# Altium project H4_6-port_EtherCAT_Junction_Module.PrjPcb (part 1 of 7)
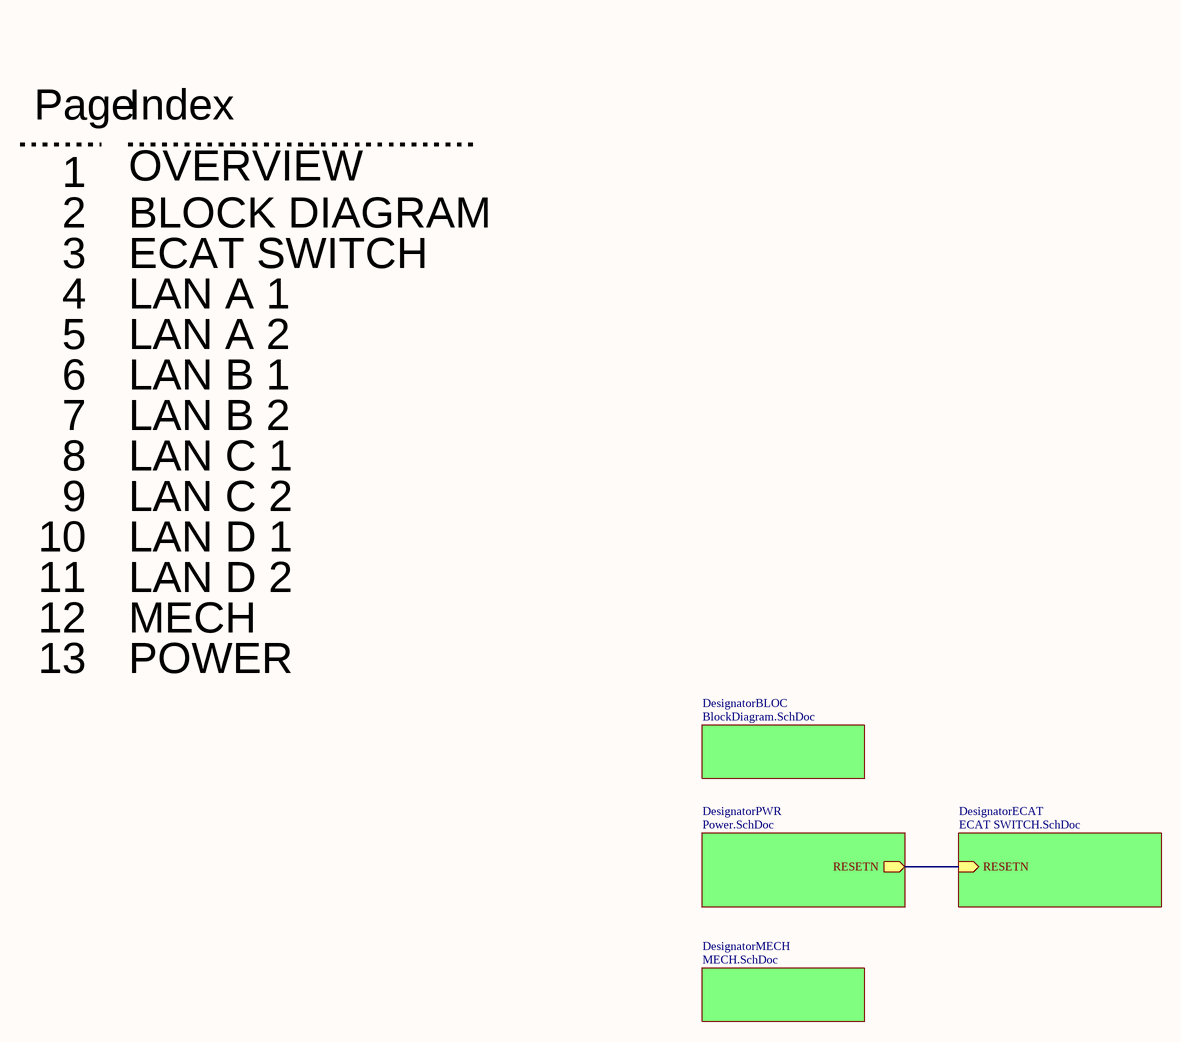
[diagram p0: Overview.SchDoc]
Cur_Revision: 1.2; Project_Title: H4 6-port EthercAT Junction Module; Project_Rev_Date_3: 2023-03-06; Project_Rev_Date_2: 2023-09-15; Project_Rev_Date: 2023-07-01; Project_Revision_Description_3: Power vias under U1 and Silkscreen update; Project_Revision_Description_2: Ethernet ESD Protections added; Project_Revision_Description: Initial release; Project_Revision_3: 1.2; Project_Revision_2: 1.1; Project_Revision: 1.0; Project_Date: 04/07/2023; Project_Author_Checked: Alexis M.; Project_Author: Chandra U.; PCB_Name: H4_6port_Junction_Module
13 sheets, 564 parts. Net scope: hierarchical (ports join the sheet entries above them; power ports are global).
Board file: H4_6-port_EtherCAT_Junction_Module.PcbDoc
Sheets:
  Overview.SchDoc
    DesignatorECAT = ECAT SWITCH.SchDoc
      LAN A - DOWNSTREAM = LAN9254_A_P2.SchDoc
      LAN B - UPSTREAM = LAN9254_B_P2.SchDoc
      LAN C - DOWNSTREAM = LAN9254_C_P2.SchDoc
      LAN D - UPSTREAM = LAN9254_D_P2.SchDoc
      LAN B = LAN9254_B_P1.SchDoc
      LAN C = LAN9254_C_P1.SchDoc
      LAN D = LAN9254_D_P1.SchDoc
      LAN A = LAN9254_A_P1.SchDoc
    DesignatorPWR = POWER.SchDoc
    DesignatorMECH = MECH.SchDoc
    DesignatorBLOC = BlockDiagram.SchDoc

## Sheet Overview.SchDoc
size 431 x 279 mm; SheetNumber: 1; SheetTotal: 13

### Sub-sheets
DesignatorBLOC = BlockDiagram.SchDoc: no entries
DesignatorECAT = ECAT SWITCH.SchDoc: RESETN (in)
DesignatorMECH = MECH.SchDoc: no entries
DesignatorPWR = Power.SchDoc: RESETN (out)

### Nets
RESETN: sheet DesignatorECAT/RESETN, sheet DesignatorPWR/RESETN

### Notes on the sheet
- Page
- Index
- 1
- OVERVIEW
- 2
- 3
- BLOCK DIAGRAM
- ECAT SWITCH
- 4
- 5
- LAN A 1
- LAN A 2
- 6
- LAN B 1
- 7
- 8
- LAN B 2
- LAN C 1
- 9
- 10
- LAN C 2
- LAN D 1
- 11
- LAN D 2
- 12
- 13
- POWER
- MECH
- REVISION
- DESCRIPTION
- DATE
- DESIGNED:
- CHECKED:
- TITLE:
- FILE NAME:
- CUR REV:
- PCB:
- SHEET:
- DATE:
- OF

## Sheet ECAT SWITCH.SchDoc
size 431 x 279 mm; DocumentNumber: 6; SheetNumber: 3; SheetTotal: 13
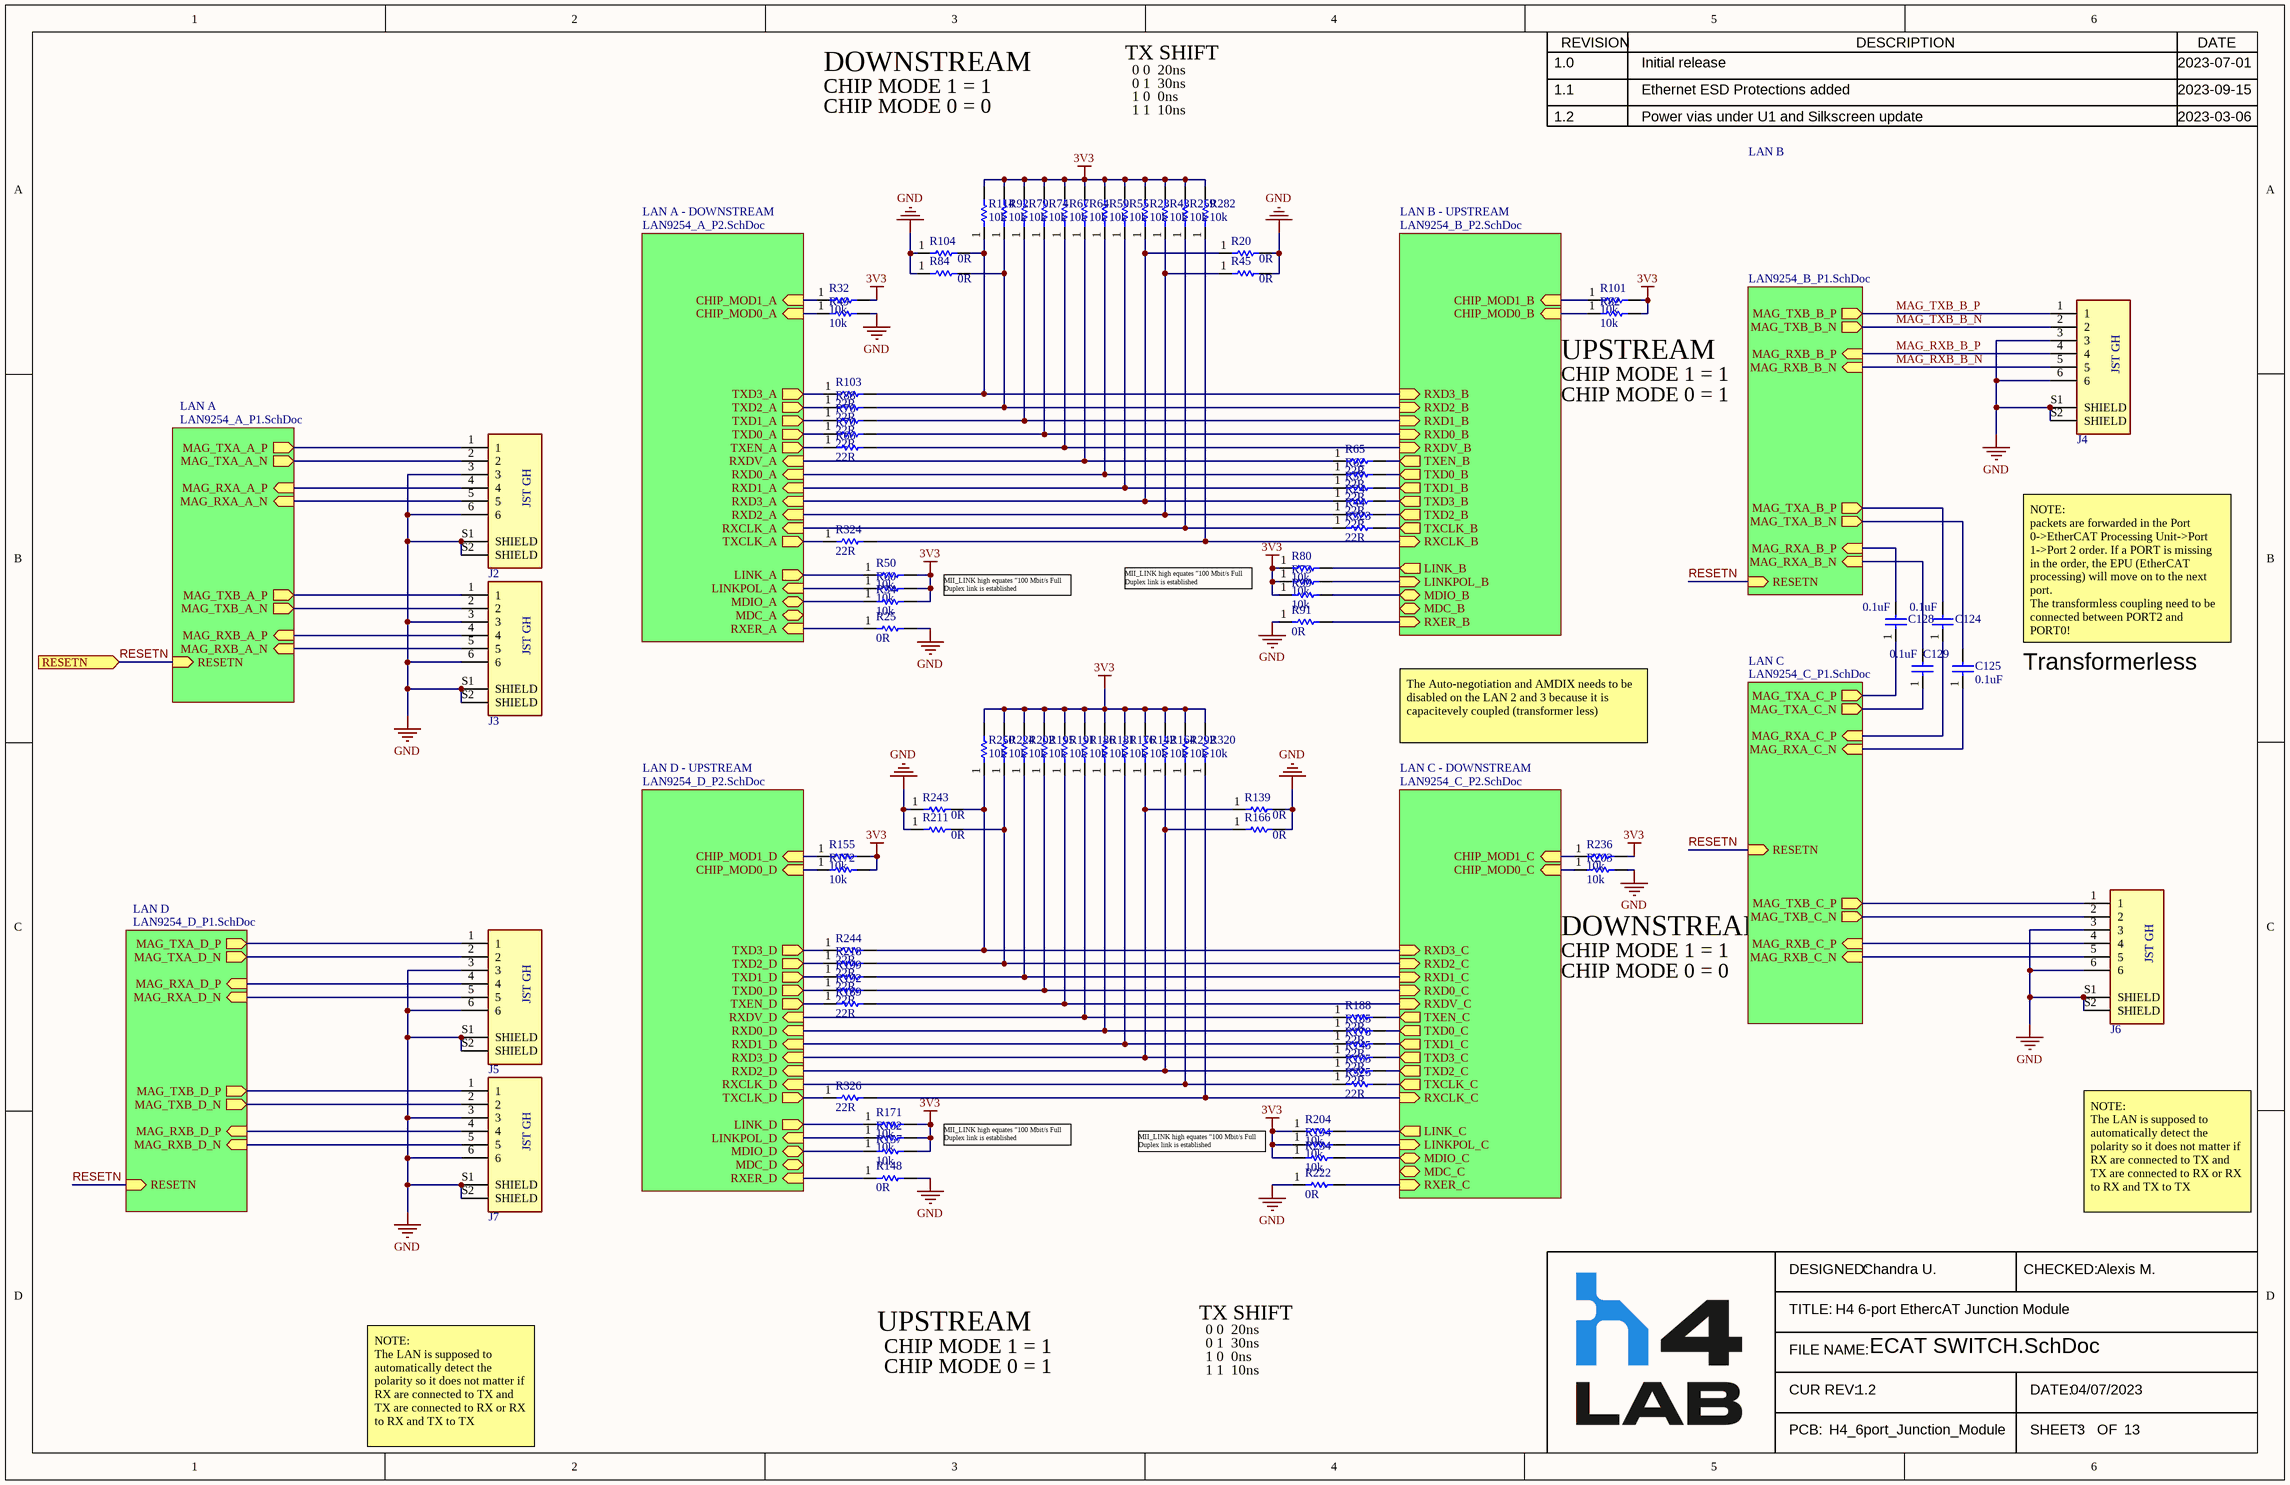
[diagram p1: ECAT SWITCH.SchDoc]

### Parts
C124  value 0.1uF  [CAPC1608X09N(0603)]  (hidden comment: CL10B104KC8NNNC)
C125  value 0.1uF  [CAPC1608X09N(0603)]  (hidden comment: CL10B104KC8NNNC)
C128  value 0.1uF  [CAPC1608X09N(0603)]  (hidden comment: CL10B104KC8NNNC)
C129  value 0.1uF  [CAPC1608X09N(0603)]  (hidden comment: CL10B104KC8NNNC)
J2  BM06B-GHS-TBT  [JST_GH_6POS_STRAI]  (value not drawn)
J3  BM06B-GHS-TBT  [JST_GH_6POS_STRAI]  (value not drawn)
J4  BM06B-GHS-TBT  [JST_GH_6POS_STRAI]  (value not drawn)
J5  BM06B-GHS-TBT  [JST_GH_6POS_STRAI]  (value not drawn)
J6  BM06B-GHS-TBT  [JST_GH_6POS_STRAI]  (value not drawn)
J7  BM06B-GHS-TBT  [JST_GH_6POS_STRAI]  (value not drawn)
R20  value 0R  [RESC1608X09N(0603)]  (hidden comment: RC0603JR-070RL)
R23  value 10k  [RESC1005X06N(0402)]  (hidden comment: RC0402FR-0710KL)
R24  value 22R  [0402]  (hidden comment: CRGP0402F22R)
R25  value 0R  [0402]  (hidden comment: RCS04020000Z0ED)
R32  value 10k  [RESC1005X06N(0402)]  (hidden comment: RC0402FR-0710KL)
R34  value 10k  [RESC1005X06N(0402)]  (hidden comment: RC0402FR-0710KL)
R43  value 10k  [RESC1005X06N(0402)]  (hidden comment: RC0402FR-0710KL)
R44  value 22R  [0402]  (hidden comment: CRGP0402F22R)
R45  value 0R  [RESC1608X09N(0603)]  (hidden comment: RC0603JR-070RL)
R49  value 10k  [RESC1005X06N(0402)]  (hidden comment: RC0402FR-0710KL)
R50  value 10k  [RESC1005X06N(0402)]  (hidden comment: RC0402FR-0710KL)
R55  value 10k  [RESC1005X06N(0402)]  (hidden comment: RC0402FR-0710KL)
R57  value 22R  [0402]  (hidden comment: CRGP0402F22R)
R59  value 10k  [RESC1005X06N(0402)]  (hidden comment: RC0402FR-0710KL)
R60  value 10k  [RESC1005X06N(0402)]  (hidden comment: RC0402FR-0710KL)
R62  value 22R  [0402]  (hidden comment: CRGP0402F22R)
R64  value 10k  [RESC1005X06N(0402)]  (hidden comment: RC0402FR-0710KL)
R65  value 22R  [0402]  (hidden comment: CRGP0402F22R)
R66  value 22R  [0402]  (hidden comment: CRGP0402F22R)
R67  value 10k  [RESC1005X06N(0402)]  (hidden comment: RC0402FR-0710KL)
R70  value 22R  [0402]  (hidden comment: CRGP0402F22R)
R73  value 10k  [RESC1005X06N(0402)]  (hidden comment: RC0402FR-0710KL)
R74  value 10k  [RESC1005X06N(0402)]  (hidden comment: RC0402FR-0710KL)
R76  value 22R  [0402]  (hidden comment: CRGP0402F22R)
R79  value 10k  [RESC1005X06N(0402)]  (hidden comment: RC0402FR-0710KL)
R80  value 10k  [RESC1005X06N(0402)]  (hidden comment: RC0402FR-0710KL)
R82  value 10k  [RESC1005X06N(0402)]  (hidden comment: RC0402FR-0710KL)
R84  value 0R  [RESC1608X09N(0603)]  (hidden comment: RC0603JR-070RL)
R88  value 22R  [0402]  (hidden comment: CRGP0402F22R)
R91  value 0R  [0402]  (hidden comment: RCS04020000Z0ED)
R92  value 10k  [RESC1005X06N(0402)]  (hidden comment: RC0402FR-0710KL)
R99  value 10k  [RESC1005X06N(0402)]  (hidden comment: RC0402FR-0710KL)
R101  value 10k  [RESC1005X06N(0402)]  (hidden comment: RC0402FR-0710KL)
R103  value 22R  [0402]  (hidden comment: CRGP0402F22R)
R104  value 0R  [RESC1608X09N(0603)]  (hidden comment: RC0603JR-070RL)
R114  value 10k  [RESC1005X06N(0402)]  (hidden comment: RC0402FR-0710KL)
R139  value 0R  [RESC1608X09N(0603)]  (hidden comment: RC0603JR-070RL)
R142  value 10k  [RESC1005X06N(0402)]  (hidden comment: RC0402FR-0710KL)
R145  value 22R  [0402]  (hidden comment: CRGP0402F22R)
R148  value 0R  [0402]  (hidden comment: RCS04020000Z0ED)
R155  value 10k  [RESC1005X06N(0402)]  (hidden comment: RC0402FR-0710KL)
R157  value 10k  [RESC1005X06N(0402)]  (hidden comment: RC0402FR-0710KL)
R164  value 10k  [RESC1005X06N(0402)]  (hidden comment: RC0402FR-0710KL)
R165  value 22R  [0402]  (hidden comment: CRGP0402F22R)
R166  value 0R  [RESC1608X09N(0603)]  (hidden comment: RC0603JR-070RL)
R171  value 10k  [RESC1005X06N(0402)]  (hidden comment: RC0402FR-0710KL)
R172  value 10k  [RESC1005X06N(0402)]  (hidden comment: RC0402FR-0710KL)
R176  value 10k  [RESC1005X06N(0402)]  (hidden comment: RC0402FR-0710KL)
R178  value 22R  [0402]  (hidden comment: CRGP0402F22R)
R181  value 10k  [RESC1005X06N(0402)]  (hidden comment: RC0402FR-0710KL)
R182  value 10k  [RESC1005X06N(0402)]  (hidden comment: RC0402FR-0710KL)
R185  value 22R  [0402]  (hidden comment: CRGP0402F22R)
R186  value 10k  [RESC1005X06N(0402)]  (hidden comment: RC0402FR-0710KL)
R188  value 22R  [0402]  (hidden comment: CRGP0402F22R)
R189  value 22R  [0402]  (hidden comment: CRGP0402F22R)
R191  value 10k  [RESC1005X06N(0402)]  (hidden comment: RC0402FR-0710KL)
R192  value 22R  [0402]  (hidden comment: CRGP0402F22R)
R194  value 10k  [RESC1005X06N(0402)]  (hidden comment: RC0402FR-0710KL)
R195  value 10k  [RESC1005X06N(0402)]  (hidden comment: RC0402FR-0710KL)
R199  value 22R  [0402]  (hidden comment: CRGP0402F22R)
R202  value 10k  [RESC1005X06N(0402)]  (hidden comment: RC0402FR-0710KL)
R203  value 10k  [RESC1005X06N(0402)]  (hidden comment: RC0402FR-0710KL)
R204  value 10k  [RESC1005X06N(0402)]  (hidden comment: RC0402FR-0710KL)
R211  value 0R  [RESC1608X09N(0603)]  (hidden comment: RC0603JR-070RL)
R218  value 22R  [0402]  (hidden comment: CRGP0402F22R)
R222  value 0R  [0402]  (hidden comment: RCS04020000Z0ED)
R224  value 10k  [RESC1005X06N(0402)]  (hidden comment: RC0402FR-0710KL)
R234  value 10k  [RESC1005X06N(0402)]  (hidden comment: RC0402FR-0710KL)
R236  value 10k  [RESC1005X06N(0402)]  (hidden comment: RC0402FR-0710KL)
R243  value 0R  [RESC1608X09N(0603)]  (hidden comment: RC0603JR-070RL)
R244  value 22R  [0402]  (hidden comment: CRGP0402F22R)
R250  value 10k  [RESC1005X06N(0402)]  (hidden comment: RC0402FR-0710KL)
R259  value 10k  [RESC1005X06N(0402)]  (hidden comment: RC0402FR-0710KL)
R282  value 10k  [RESC1005X06N(0402)]  (hidden comment: RC0402FR-0710KL)
R292  value 10k  [RESC1005X06N(0402)]  (hidden comment: RC0402FR-0710KL)
R320  value 10k  [RESC1005X06N(0402)]  (hidden comment: RC0402FR-0710KL)
R323  value 22R  [0402]  (hidden comment: CRGP0402F22R)
R324  value 22R  [0402]  (hidden comment: CRGP0402F22R)
R325  value 22R  [0402]  (hidden comment: CRGP0402F22R)
R326  value 22R  [0402]  (hidden comment: CRGP0402F22R)

### Sub-sheets
LAN A = LAN9254_A_P1.SchDoc: MAG_TXA_A_P (out), MAG_TXA_A_N (out), MAG_RXA_A_P (in), MAG_RXA_A_N (in), MAG_TXB_A_P (out), MAG_TXB_A_N (out), MAG_RXB_A_P (in), MAG_RXB_A_N (in), RESETN (in)
LAN A - DOWNSTREAM = LAN9254_A_P2.SchDoc: CHIP_MOD0_A (in), CHIP_MOD1_A (in), TXD3_A (out), TXD2_A (out), TXD1_A (out), TXD0_A (out), TXEN_A (out), RXD0_A (in), RXD1_A (in), LINKPOL_A (in), RXD3_A (in), RXD2_A (in), RXER_A (in), RXCLK_A (in), MDIO_A (bidir), MDC_A (bidir), LINK_A (out), RXDV_A (in), TXCLK_A (out)
LAN B = LAN9254_B_P1.SchDoc: MAG_TXA_B_P (out), MAG_TXA_B_N (out), MAG_RXA_B_P (in), MAG_RXA_B_N (in), MAG_TXB_B_P (out), MAG_TXB_B_N (out), MAG_RXB_B_P (in), MAG_RXB_B_N (in), RESETN (in)
LAN B - UPSTREAM = LAN9254_B_P2.SchDoc: CHIP_MOD0_B (in), CHIP_MOD1_B (in), TXD3_B (out), TXD2_B (out), TXD1_B (out), TXD0_B (out), TXEN_B (out), RXD0_B (in), RXD1_B (in), LINKPOL_B (in), RXD3_B (in), RXD2_B (in), RXER_B (in), RXCLK_B (in), MDIO_B (bidir), MDC_B (bidir), LINK_B (out), RXDV_B (in), TXCLK_B (out)
LAN C = LAN9254_C_P1.SchDoc: MAG_TXA_C_P (out), MAG_TXA_C_N (out), MAG_RXA_C_P (in), MAG_RXA_C_N (in), MAG_TXB_C_P (out), MAG_TXB_C_N (out), MAG_RXB_C_P (in), MAG_RXB_C_N (in), RESETN (in)
LAN C - DOWNSTREAM = LAN9254_C_P2.SchDoc: CHIP_MOD0_C (in), CHIP_MOD1_C (in), TXD3_C (out), TXD2_C (out), TXD1_C (out), TXD0_C (out), TXEN_C (out), RXD0_C (in), RXD1_C (in), LINKPOL_C (in), RXD3_C (in), RXD2_C (in), RXER_C (in), RXCLK_C (in), MDIO_C (bidir), MDC_C (bidir), LINK_C (out), RXDV_C (in), TXCLK_C (out)
LAN D = LAN9254_D_P1.SchDoc: MAG_TXA_D_P (out), MAG_TXA_D_N (out), MAG_RXA_D_P (in), MAG_RXA_D_N (in), MAG_TXB_D_P (out), MAG_TXB_D_N (out), MAG_RXB_D_P (in), MAG_RXB_D_N (in), RESETN (in)
LAN D - UPSTREAM = LAN9254_D_P2.SchDoc: CHIP_MOD0_D (in), CHIP_MOD1_D (in), TXD3_D (out), TXD2_D (out), TXD1_D (out), TXD0_D (out), TXEN_D (out), RXD0_D (in), RXD1_D (in), LINKPOL_D (in), RXD3_D (in), RXD2_D (in), RXER_D (in), RXCLK_D (in), MDIO_D (bidir), MDC_D (bidir), LINK_D (out), RXDV_D (in), TXCLK_D (out)

### Ports
RESETN (in, see Overview[4D], LAN9254_A_P1[2B], LAN9254_B_P1[2B], LAN9254_C_P1[2B], LAN9254_D_P1[2B], POWER[2D])

### Nets
3V3: R23.2 R32.2 R34.2 R43.2 R50.2 R55.2 R59.2 R60.2 R64.2 R67.2 R73.1 R74.2 R79.2 R80.1 R82.2 R92.2 R99.1 R101.2 R114.2 R142.2 R155.2 R157.2 R164.2 R171.2 R172.2 R176.2 R181.2 R182.2 R186.2 R191.2 R194.1 R195.2 R202.2 R204.1 R224.2 R234.1 R236.2 R250.2 R259.2 R282.2 R292.2 R320.2
GND: J2.3 J2.6 J2.S1(SHIELD) J2.S2(SHIELD) J3.3 J3.6 J3.S1(SHIELD) J3.S2(SHIELD) J4.3 J4.6 J4.S1(SHIELD) J4.S2(SHIELD) J5.3 J5.6 J5.S1(SHIELD) J5.S2(SHIELD) J6.3 J6.6 J6.S1(SHIELD) J6.S2(SHIELD) J7.3 J7.6 J7.S1(SHIELD) J7.S2(SHIELD) R20.2 R25.2 R45.2 R49.2 R84.1 R91.1 R104.1 R139.2 R148.2 R166.2 R203.2 R211.1 R222.1 R243.1
CHIP_MOD0_A: R49.1 ; sheet LAN A - DOWNSTREAM/CHIP_MOD0_A
CHIP_MOD0_B: R82.1 ; sheet LAN B - UPSTREAM/CHIP_MOD0_B
CHIP_MOD0_C: R203.1 ; sheet LAN C - DOWNSTREAM/CHIP_MOD0_C
CHIP_MOD0_D: R172.1 ; sheet LAN D - UPSTREAM/CHIP_MOD0_D
CHIP_MOD1_A: R32.1 ; sheet LAN A - DOWNSTREAM/CHIP_MOD1_A
CHIP_MOD1_B: R101.1 ; sheet LAN B - UPSTREAM/CHIP_MOD1_B
CHIP_MOD1_C: R236.1 ; sheet LAN C - DOWNSTREAM/CHIP_MOD1_C
CHIP_MOD1_D: R155.1 ; sheet LAN D - UPSTREAM/CHIP_MOD1_D
DIGIO3_A: R50.1 ; sheet LAN A - DOWNSTREAM/LINK_A
DIGIO3_B: R80.2 ; sheet LAN B - UPSTREAM/LINK_B
DIGIO3_C: R204.2 ; sheet LAN C - DOWNSTREAM/LINK_C
DIGIO3_D: R171.1 ; sheet LAN D - UPSTREAM/LINK_D
DIGIO10_A: R60.1 ; sheet LAN A - DOWNSTREAM/LINKPOL_A
DIGIO10_B: R73.2 ; sheet LAN B - UPSTREAM/LINKPOL_B
DIGIO10_C: R194.2 ; sheet LAN C - DOWNSTREAM/LINKPOL_C
DIGIO10_D: R182.1 ; sheet LAN D - UPSTREAM/LINKPOL_D
MAG_RXA_A_N: J2.5 ; sheet LAN A/MAG_RXA_A_N
MAG_RXA_A_P: J2.4 ; sheet LAN A/MAG_RXA_A_P
MAG_RXA_D_N: J5.5 ; sheet LAN D/MAG_RXA_D_N
MAG_RXA_D_P: J5.4 ; sheet LAN D/MAG_RXA_D_P
MAG_RXB_A_N: J3.5 ; sheet LAN A/MAG_RXB_A_N
MAG_RXB_A_P: J3.4 ; sheet LAN A/MAG_RXB_A_P
MAG_RXB_B_N: J4.5 ; sheet LAN B/MAG_RXB_B_N
MAG_RXB_B_P: J4.4 ; sheet LAN B/MAG_RXB_B_P
MAG_RXB_C_N: J6.5 ; sheet LAN C/MAG_RXB_C_N
MAG_RXB_C_P: J6.4 ; sheet LAN C/MAG_RXB_C_P
MAG_RXB_D_N: J7.5 ; sheet LAN D/MAG_RXB_D_N
MAG_RXB_D_P: J7.4 ; sheet LAN D/MAG_RXB_D_P
MAG_TXA_A_N: J2.2 ; sheet LAN A/MAG_TXA_A_N
MAG_TXA_A_P: J2.1 ; sheet LAN A/MAG_TXA_A_P
MAG_TXA_D_N: J5.2 ; sheet LAN D/MAG_TXA_D_N
MAG_TXA_D_P: J5.1 ; sheet LAN D/MAG_TXA_D_P
MAG_TXB_A_N: J3.2 ; sheet LAN A/MAG_TXB_A_N
MAG_TXB_A_P: J3.1 ; sheet LAN A/MAG_TXB_A_P
MAG_TXB_B_N: J4.2 ; sheet LAN B/MAG_TXB_B_N
MAG_TXB_B_P: J4.1 ; sheet LAN B/MAG_TXB_B_P
MAG_TXB_C_N: J6.2 ; sheet LAN C/MAG_TXB_C_N
MAG_TXB_C_P: J6.1 ; sheet LAN C/MAG_TXB_C_P
MAG_TXB_D_N: J7.2 ; sheet LAN D/MAG_TXB_D_N
MAG_TXB_D_P: J7.1 ; sheet LAN D/MAG_TXB_D_P
MDIO_A: R34.1 ; sheet LAN A - DOWNSTREAM/MDIO_A
MDIO_B: R99.2 ; sheet LAN B - UPSTREAM/MDIO_B
MDIO_C: R234.2 ; sheet LAN C - DOWNSTREAM/MDIO_C
MDIO_D: R157.1 ; sheet LAN D - UPSTREAM/MDIO_D
P0_RD_B_N: C129.2 ; sheet LAN B/MAG_RXA_B_N
P0_RD_B_P: C128.2 ; sheet LAN B/MAG_RXA_B_P
P0_RD_C_N: C125.1 ; sheet LAN C/MAG_RXA_C_N
P0_RD_C_P: C124.1 ; sheet LAN C/MAG_RXA_C_P
P0_TD_B_N: C125.2 ; sheet LAN B/MAG_TXA_B_N
P0_TD_B_P: C124.2 ; sheet LAN B/MAG_TXA_B_P
P0_TD_C_N: C129.1 ; sheet LAN C/MAG_TXA_C_N
P0_TD_C_P: C128.1 ; sheet LAN C/MAG_TXA_C_P
RESETN: port RESETN, sheet LAN B/RESETN, sheet LAN C/RESETN, sheet LAN D/RESETN, sheet LAN A/RESETN
RXCLK_A: R259.1 R323.1 ; sheet LAN A - DOWNSTREAM/RXCLK_A
RXCLK_B: R282.1 R324.2 ; sheet LAN B - UPSTREAM/RXCLK_B
RXCLK_C: R320.1 R326.2 ; sheet LAN C - DOWNSTREAM/RXCLK_C
RXCLK_D: R292.1 R325.1 ; sheet LAN D - UPSTREAM/RXCLK_D
RXD0_A: R59.1 R62.1 ; sheet LAN A - DOWNSTREAM/RXD0_A
RXD0_B: R70.2 R74.1 ; sheet LAN B - UPSTREAM/RXD0_B
RXD0_C: R192.2 R195.1 ; sheet LAN C - DOWNSTREAM/RXD0_C
RXD0_D: R181.1 R185.1 ; sheet LAN D - UPSTREAM/RXD0_D
RXD1_A: R55.1 R57.1 ; sheet LAN A - DOWNSTREAM/RXD1_A
RXD1_B: R76.2 R79.1 ; sheet LAN B - UPSTREAM/RXD1_B
RXD1_C: R199.2 R202.1 ; sheet LAN C - DOWNSTREAM/RXD1_C
RXD1_D: R176.1 R178.1 ; sheet LAN D - UPSTREAM/RXD1_D
RXD2_A: R43.1 R44.1 R45.1 ; sheet LAN A - DOWNSTREAM/RXD2_A
RXD2_B: R84.2 R88.2 R92.1 ; sheet LAN B - UPSTREAM/RXD2_B
RXD2_C: R211.2 R218.2 R224.1 ; sheet LAN C - DOWNSTREAM/RXD2_C
RXD2_D: R164.1 R165.1 R166.1 ; sheet LAN D - UPSTREAM/RXD2_D
RXD3_A: R20.1 R23.1 R24.1 ; sheet LAN A - DOWNSTREAM/RXD3_A
RXD3_B: R103.2 R104.2 R114.1 ; sheet LAN B - UPSTREAM/RXD3_B
RXD3_C: R243.2 R244.2 R250.1 ; sheet LAN C - DOWNSTREAM/RXD3_C
RXD3_D: R139.1 R142.1 R145.1 ; sheet LAN D - UPSTREAM/RXD3_D
RXDV_A: R64.1 R65.1 ; sheet LAN A - DOWNSTREAM/RXDV_A
RXDV_B: R66.2 R67.1 ; sheet LAN B - UPSTREAM/RXDV_B
RXDV_C: R189.2 R191.1 ; sheet LAN C - DOWNSTREAM/RXDV_C
RXDV_D: R186.1 R188.1 ; sheet LAN D - UPSTREAM/RXDV_D
RXER_A: R25.1 ; sheet LAN A - DOWNSTREAM/RXER_A
RXER_B: R91.2 ; sheet LAN B - UPSTREAM/RXER_B
RXER_C: R222.2 ; sheet LAN C - DOWNSTREAM/RXER_C
RXER_D: R148.1 ; sheet LAN D - UPSTREAM/RXER_D
TXCLK_A: R324.1 ; sheet LAN A - DOWNSTREAM/TXCLK_A
TXCLK_B: R323.2 ; sheet LAN B - UPSTREAM/TXCLK_B
TXCLK_C: R325.2 ; sheet LAN C - DOWNSTREAM/TXCLK_C
TXCLK_D: R326.1 ; sheet LAN D - UPSTREAM/TXCLK_D
TXD0_A: R70.1 ; sheet LAN A - DOWNSTREAM/TXD0_A
TXD0_B: R62.2 ; sheet LAN B - UPSTREAM/TXD0_B
TXD0_C: R185.2 ; sheet LAN C - DOWNSTREAM/TXD0_C
TXD0_D: R192.1 ; sheet LAN D - UPSTREAM/TXD0_D
TXD1_A: R76.1 ; sheet LAN A - DOWNSTREAM/TXD1_A
TXD1_B: R57.2 ; sheet LAN B - UPSTREAM/TXD1_B
TXD1_C: R178.2 ; sheet LAN C - DOWNSTREAM/TXD1_C
TXD1_D: R199.1 ; sheet LAN D - UPSTREAM/TXD1_D
TXD2_A: R88.1 ; sheet LAN A - DOWNSTREAM/TXD2_A
TXD2_B: R44.2 ; sheet LAN B - UPSTREAM/TXD2_B
TXD2_C: R165.2 ; sheet LAN C - DOWNSTREAM/TXD2_C
TXD2_D: R218.1 ; sheet LAN D - UPSTREAM/TXD2_D
TXD3_A: R103.1 ; sheet LAN A - DOWNSTREAM/TXD3_A
TXD3_B: R24.2 ; sheet LAN B - UPSTREAM/TXD3_B
TXD3_C: R145.2 ; sheet LAN C - DOWNSTREAM/TXD3_C
TXD3_D: R244.1 ; sheet LAN D - UPSTREAM/TXD3_D
TXEN_A: R66.1 ; sheet LAN A - DOWNSTREAM/TXEN_A
TXEN_B: R65.2 ; sheet LAN B - UPSTREAM/TXEN_B
TXEN_C: R188.2 ; sheet LAN C - DOWNSTREAM/TXEN_C
TXEN_D: R189.1 ; sheet LAN D - UPSTREAM/TXEN_D

### Notes on the sheet
- DOWNSTREAM
- CHIP MODE 1 = 1
- TX SHIFT
- 0 0  20ns
- 0 1  30ns
- CHIP MODE 0 = 0
- 1 0  0ns
- 1 1  10ns
- UPSTREAM
- CHIP MODE 0 = 1
- MII_LINK high equates “100 Mbit/s Full
  Duplex link is established
- NOTE:
  packets are forwarded in the Port 0->EtherCAT Processing Unit->Port 1->Port 2 order. If a PORT is missing in the order, the EPU (EtherCAT processing) will move on to the next port.
  The transformless coupling need to be connected between PORT2 and PORT0!
- Transformerless
- The Auto-negotiation and AMDIX needs to be disabled on the LAN 2 and 3 because it is capacitevely coupled (transformer less)
- NOTE:
  The LAN is supposed to automatically detect the polarity so it does not matter if RX are connected to TX and TX are connected to RX or RX to RX and TX to TX
- REVISION
- DESCRIPTION
- DATE
- DESIGNED:
- CHECKED:
- TITLE:
- FILE NAME:
- CUR REV:
- PCB:
- SHEET:
- DATE:
- OF
- (in symbol BM06B-GHS-TBT_JST_6POS_1.25MM_CON) JST GH

### Library data of the parts
C124 C125 C128 C129 = 0.1uF_100V_0603_CAP: CAP CER 0.1UF 100V X7R 0603; Tolerance: 10%; MPN: CL10B104KC8NNNC; Volage Rating: 100V; Temp Coefficent: X7R; Mounting Type: Surface Mount; Case/Package: 0603; Supplier 1: Digi-Key; Supplier Part Number 1: 1276-6807-1-ND
J2-J7 = BM06B-GHS-TBT_JST_6POS_1.25MM_CON: CONN HEADER GH TOP 6POS 1.25MM; Manufacturer: JST; Manufacturer Part Number: BM06B-GHS-TBT(LF)(SN)(N); Pitch: 0.049inch; Max Current Rating: 1A; Contact Resistance: 50mR; Number of Positions: 6; Max Voltage Rating (AC): 50V; Connector Type: Outer Shroud Contact; Number of Rows: 1; Supplier 1: Digi-Key; RoHS: Yes; Category: Connectors; Pricing 1: 1=0.51000, 10=0.47700, 100=0.36540, 500=0.31770, 1000=0.26211 (USD); Mount: Surface Mount; Color: Natural; Contact Plating: Tin,Copper; Contact Material: Bronze; Housing Color: Beige; Housing Material: Polyamide; Min Operating Temperature: -25°C; Max Operating Temperature: 85°C; Fastening Type: Ramp; Packaging: Tape and Reel; Termination: Solder; Orientation: Straight; Length: 10.75mm; Depth: 4.25mm; Lead Free: Lead Free; ComponentLink1URL: https://datasheet.ciiva.com/712/egh-712475.pdf?src-supplier=Digi-Key; ComponentLink1Description: https://datasheet.ciiva.com/712/egh-712475.pdf?src-supplier=Digi-Key; ComponentLink2URL: https://datasheet.ciiva.com/712/egh-712476.pdf?src-supplier=Digi-Key; ComponentLink2Description: https://datasheet.ciiva.com/712/egh-712476.pdf?src-supplier=Digi-Key; Supplier Part Number 1: 455-1582-1-ND; Series: GH; Contact Type: Outer Shroud Contact; ComponentLink3URL: https://datasheet.ciiva.com/730/egh-730626.pdf?src-supplier=Digi-Key; ComponentLink3Description: https://datasheet.ciiva.com/730/egh-730626.pdf?src-supplier=Digi-Key
R20 R45 R84 R104 R139 R166 R211 R243 = 0R_1/10W_0603_RES: RES SMD 0 OHM JUMPER 1/10W 0603; MPN: RC0603JR-070RL; Tolerance: Jumper; Power: 1/10W; Package/Case: 0603; Supplier 1: Digi-Key; Supplier Part Number 1: 311-0.0GRDKR-ND
R23 R32 R34 R43 R49 R50 R55 R59 R60 R64 R67 R73 R74 R79 R80 R82 R92 R99 R101 R114 R142 R155 R157 R164 R171 R172 R176 R181 R182 R186 R191 R194 R195 R202-R204 R224 R234 R236 R250 R259 R282 R292 R320 = 10k_1/16W_0402_RES: RES SMD 10K OHM 1% 1/16W 0402; MPN: RC0402FR-0710KL; Tolerance: 1%; Power: 1/16W; Size: 0402
R24 R44 R57 R62 R65 R66 R70 R76 R88 R103 R145 R165 R178 R185 R188 R189 R192 R199 R218 R244 R323-R326 = 22R_1/8W_1%_0402_CRGP0402F22R_RES: Res Thick Film 0402 22 Ohm 1% 0.125W(1/8W) ±200ppm/C Pad SMD T/R; Manufacturer: TE Connectivity; Supplier 1: Digi-Key; Manufacturer Part Number: CRGP0402F22R; RoHS: Yes; Category: Chip SMD Resistors; Stock 1: 34384; Pricing 1: 1=0.12000, 10=0.10900, 100=0.04180, 1000=0.01839, 2500=0.01588, 5000=0.01421 (USD); RoHS Compliant: Yes; Supplier Part Number 1: A130335CT-ND
R25 R91 R148 R222 = 0R_1/5W_0402_RCS04020000Z0ED_RES: VISHAY - RCS04020000Z0ED - SMD Chip Resistor, 0402 [1005 Metric], 0 ohm, RCS Series, 50 V, Thick Film, 200 mW; Manufacturer: Vishay Dale; Resistance: 0mR; Max Power Dissipation: 200mW; Supplier 1: Digi-Key; Supplier Part Number 1: 541-2877-1-ND; Manufacturer Part Number: RCS04020000Z0ED; RoHS: Yes; Category: Chip SMD Resistors; Stock 1: 18214; Pricing 1: 1=0.10000, 10=0.08300, 25=0.05760, 50=0.04480, 100=0.03200, 250=0.02496, 500=0.01984, 1000=0.01408, 5000=0.01088 (USD); Case/Package: 0402; Case Code (Metric): 1005; Case Code (Imperial): 0402; Min Operating Temperature: -55°C; Max Operating Temperature: 155°C; Packaging: Tape and Reel; Resistor Type: Thick Film; Number of Terminations: 2; Features: Automotive AEC-Q200; Length: 0.039inch; Width: 0.02inch; Height: 0.016inch; RoHS Compliant: Yes; ComponentLink1URL: http://www.farnell.com/datasheets/2618474.pdf?src-supplier=Farnell; ComponentLink1Description: http://www.farnell.com/datasheets/2618474.pdf?src-supplier=Farnell; ComponentLink2URL: http://www.vishay.com/docs/20065/rcse3.pdf?src-supplier=Digi-Key; ComponentLink2Description: http://www.vishay.com/docs/20065/rcse3.pdf?src-supplier=Digi-Key; ComponentLink3URL: http://www.farnell.com/datasheets/2618474.pdf?src-supplier=Element14; ComponentLink3Description: http://www.farnell.com/datasheets/2618474.pdf?src-supplier=Element14; ComponentLink4URL: http://www.farnell.com/datasheets/2618474.pdf?src-supplier=Newark; ComponentLink4Description: http://www.farnell.com/datasheets/2618474.pdf?src-supplier=Newark

## Sheet LAN9254_A_P2.SchDoc
size 431 x 279 mm; DocumentNumber: 5; SheetNumber: 5; SheetTotal: 13
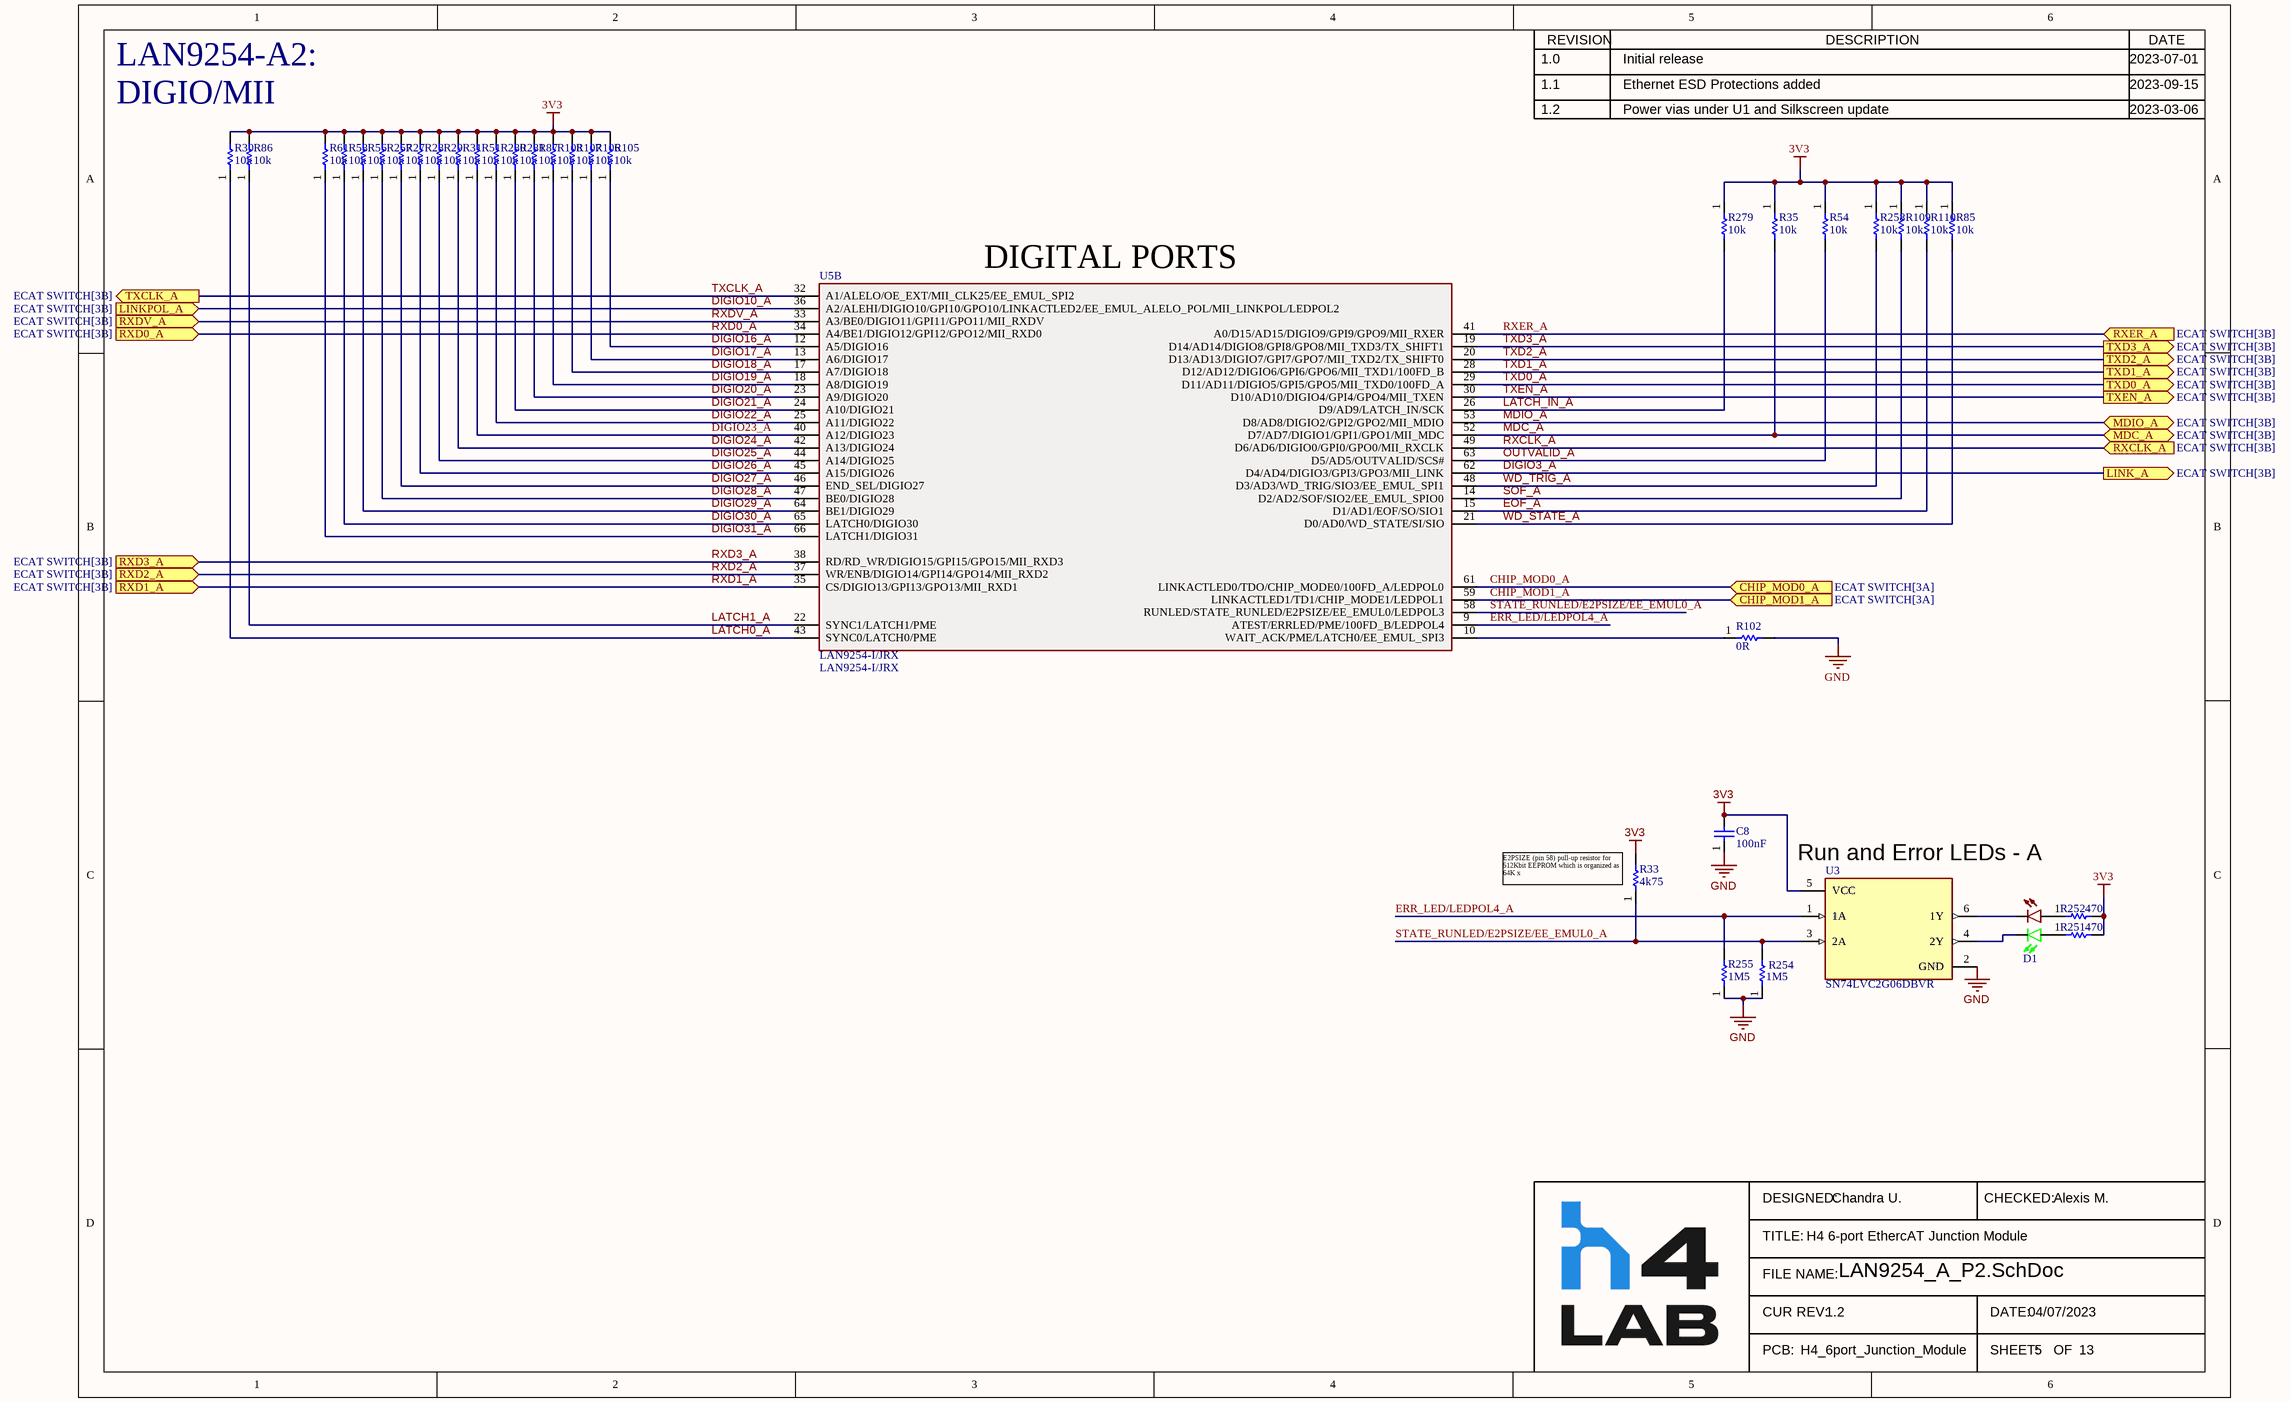
[diagram p2: LAN9254_A_P2.SchDoc]

### Parts
C8  value 100nF  [CAPC1005X03N(0402)]  (hidden comment: GRM155R71C104JA88D)
D1  LTST-C195KGJRKT  [Dual_LED]  (value not drawn)
R27  value 10k  [RESC1005X06N(0402)]  (hidden comment: RC0402FR-0710KL)
R28  value 10k  [RESC1005X06N(0402)]  (hidden comment: RC0402FR-0710KL)
R29  value 10k  [RESC1005X06N(0402)]  (hidden comment: RC0402FR-0710KL)
R30  value 10k  [RESC1005X06N(0402)]  (hidden comment: RC0402FR-0710KL)
R31  value 10k  [RESC1005X06N(0402)]  (hidden comment: RC0402FR-0710KL)
R33  value 4k75  [RESC1005X06N(0402)]  (hidden comment: RC0402FR-074K75L)
R35  value 10k  [RESC1005X06N(0402)]  (hidden comment: RC0402FR-0710KL)
R51  value 10k  [RESC1005X06N(0402)]  (hidden comment: RC0402FR-0710KL)
R54  value 10k  [RESC1005X06N(0402)]  (hidden comment: RC0402FR-0710KL)
R56  value 10k  [RESC1005X06N(0402)]  (hidden comment: RC0402FR-0710KL)
R58  value 10k  [RESC1005X06N(0402)]  (hidden comment: RC0402FR-0710KL)
R61  value 10k  [RESC1005X06N(0402)]  (hidden comment: RC0402FR-0710KL)
R85  value 10k  [RESC1005X06N(0402)]  (hidden comment: RC0402FR-0710KL)
R86  value 10k  [RESC1005X06N(0402)]  (hidden comment: RC0402FR-0710KL)
R87  value 10k  [RESC1005X06N(0402)]  (hidden comment: RC0402FR-0710KL)
R102  value 0R  [0402]  (hidden comment: RCS04020000Z0ED)
R105  value 10k  [RESC1005X06N(0402)]  (hidden comment: RC0402FR-0710KL)
R106  value 10k  [RESC1005X06N(0402)]  (hidden comment: RC0402FR-0710KL)
R107  value 10k  [RESC1005X06N(0402)]  (hidden comment: RC0402FR-0710KL)
R108  value 10k  [RESC1005X06N(0402)]  (hidden comment: RC0402FR-0710KL)
R109  value 10k  [RESC1005X06N(0402)]  (hidden comment: RC0402FR-0710KL)
R110  value 10k  [RESC1005X06N(0402)]  (hidden comment: RC0402FR-0710KL)
R251  value 470  [0402]  (hidden comment: CRCW0402470RJNED)
R252  value 470  [0402]  (hidden comment: CRCW0402470RJNED)
R254  value 1M5  [0402]  (hidden comment: CRCW04021M50JNED)
R255  value 1M5  [0402]  (hidden comment: CRCW04021M50JNED)
R257  value 10k  [RESC1005X06N(0402)]  (hidden comment: RC0402FR-0710KL)
R258  value 10k  [RESC1005X06N(0402)]  (hidden comment: RC0402FR-0710KL)
R279  value 10k  [RESC1005X06N(0402)]  (hidden comment: RC0402FR-0710KL)
R280  value 10k  [RESC1005X06N(0402)]  (hidden comment: RC0402FR-0710KL)
R281  value 10k  [RESC1005X06N(0402)]  (hidden comment: RC0402FR-0710KL)
U3  SN74LVC2G06DBVR  [FP-DBV0006A-IPC_C]
U5  LAN9254-I/JRX  [QFP50P1400X1400X120-81N]  (part B of 2)

### Ports
CHIP_MOD0_A (in, see ECAT SWITCH[3A]), CHIP_MOD1_A (in, see ECAT SWITCH[3A]), LINK_A (out, see ECAT SWITCH[3B]), LINKPOL_A (in, see ECAT SWITCH[3B]), MDC_A (bidir, see ECAT SWITCH[3B]), MDIO_A (bidir, see ECAT SWITCH[3B]), RXCLK_A (in, see ECAT SWITCH[3B]), RXD0_A (in, see ECAT SWITCH[3B]), RXD1_A (in, see ECAT SWITCH[3B]), RXD2_A (in, see ECAT SWITCH[3B]), RXD3_A (in, see ECAT SWITCH[3B]), RXDV_A (in, see ECAT SWITCH[3B]), RXER_A (in, see ECAT SWITCH[3B]), TXCLK_A (out, see ECAT SWITCH[3B]), TXD0_A (out, see ECAT SWITCH[3B]), TXD1_A (out, see ECAT SWITCH[3B]), TXD2_A (out, see ECAT SWITCH[3B]), TXD3_A (out, see ECAT SWITCH[3B]), TXEN_A (out, see ECAT SWITCH[3B])

### Nets
3V3: C8.2 R27.2 R28.2 R29.2 R30.2 R31.2 R33.2 R35.1 R51.2 R54.1 R56.2 R58.2 R61.2 R85.1 R86.2 R87.2 R105.2 R106.2 R107.2 R108.2 R109.1 R110.1 R251.2 R252.2 R257.2 R258.1 R279.1 R280.2 R281.2 U3.5(VCC)
GND: C8.1 R102.2 R254.1 R255.1 U3.2(GND)
CHIP_MOD0_A: U5.61(LINKACTLED0/TDO/CHIP_MODE0/100FD_A/LEDPOL0) ; port CHIP_MOD0_A
CHIP_MOD1_A: U5.59(LINKACTLED1/TD1/CHIP_MODE1/LEDPOL1) ; port CHIP_MOD1_A
DIGIO3_A: U5.62(D4/AD4/DIGIO3/GPI3/GPO3/MII_LINK) ; port LINK_A
DIGIO10_A: U5.36(A2/ALEHI/DIGIO10/GPI10/GPO10/LINKACTLED2/EE_EMUL_ALELO_POL/MII_LINKPOL/LEDPOL2) ; port LINKPOL_A
DIGIO16_A: R105.1 U5.12(A5/DIGIO16)
DIGIO17_A: R106.1 U5.13(A6/DIGIO17)
DIGIO18_A: R107.1 U5.17(A7/DIGIO18)
DIGIO19_A: R108.1 U5.18(A8/DIGIO19)
DIGIO20_A: R87.1 U5.23(A9/DIGIO20)
DIGIO21_A: R281.1 U5.24(A10/DIGIO21)
DIGIO22_A: R280.1 U5.25(A11/DIGIO22)
DIGIO23_A: R51.1 U5.40(A12/DIGIO23)
DIGIO24_A: R31.1 U5.42(A13/DIGIO24)
DIGIO25_A: R29.1 U5.44(A14/DIGIO25)
DIGIO26_A: R28.1 U5.45(A15/DIGIO26)
DIGIO27_A: R27.1 U5.46(END_SEL/DIGIO27)
DIGIO28_A: R257.1 U5.47(BE0/DIGIO28)
DIGIO29_A: R56.1 U5.64(BE1/DIGIO29)
DIGIO30_A: R58.1 U5.65(LATCH0/DIGIO30)
DIGIO31_A: R61.1 U5.66(LATCH1/DIGIO31)
EOF_A: R110.2 U5.15(D1/AD1/EOF/SO/SIO1)
ERR_LED/LEDPOL4_A: R255.2 U3.1(1A) U5.9(ATEST/ERRLED/PME/100FD_B/LEDPOL4)
LATCH0_A: R30.1 U5.43(SYNC0/LATCH0/PME)
LATCH1_A: R86.1 U5.22(SYNC1/LATCH1/PME)
LATCH_IN_A: R279.2 U5.26(D9/AD9/LATCH_IN/SCK)
MDC_A: R35.2 U5.52(D7/AD7/DIGIO1/GPI1/GPO1/MII_MDC) ; port MDC_A
MDIO_A: U5.53(D8/AD8/DIGIO2/GPI2/GPO2/MII_MDIO) ; port MDIO_A
OUTVALID_A: R54.2 U5.63(D5/AD5/OUTVALID/SCS#)
RXCLK_A: U5.49(D6/AD6/DIGIO0/GPI0/GPO0/MII_RXCLK) ; port RXCLK_A
RXD0_A: U5.34(A4/BE1/DIGIO12/GPI12/GPO12/MII_RXD0) ; port RXD0_A
RXD1_A: U5.35(CS/DIGIO13/GPI13/GPO13/MII_RXD1) ; port RXD1_A
RXD2_A: U5.37(WR/ENB/DIGIO14/GPI14/GPO14/MII_RXD2) ; port RXD2_A
RXD3_A: U5.38(RD/RD_WR/DIGIO15/GPI15/GPO15/MII_RXD3) ; port RXD3_A
RXDV_A: U5.33(A3/BE0/DIGIO11/GPI11/GPO11/MII_RXDV) ; port RXDV_A
RXER_A: U5.41(A0/D15/AD15/DIGIO9/GPI9/GPO9/MII_RXER) ; port RXER_A
SOF_A: R109.2 U5.14(D2/AD2/SOF/SIO2/EE_EMUL_SPIO0)
STATE_RUNLED/E2PSIZE/EE_EMUL0_A: R33.1 R254.2 U3.3(2A) U5.58(RUNLED/STATE_RUNLED/E2PSIZE/EE_EMUL0/LEDPOL3)
TXCLK_A: U5.32(A1/ALELO/OE_EXT/MII_CLK25/EE_EMUL_SPI2) ; port TXCLK_A
TXD0_A: U5.29(D11/AD11/DIGIO5/GPI5/GPO5/MII_TXD0/100FD_A) ; port TXD0_A
TXD1_A: U5.28(D12/AD12/DIGIO6/GPI6/GPO6/MII_TXD1/100FD_B) ; port TXD1_A
TXD2_A: U5.20(D13/AD13/DIGIO7/GPI7/GPO7/MII_TXD2/TX_SHIFT0) ; port TXD2_A
TXD3_A: U5.19(D14/AD14/DIGIO8/GPI8/GPO8/MII_TXD3/TX_SHIFT1) ; port TXD3_A
TXEN_A: U5.30(D10/AD10/DIGIO4/GPI4/GPO4/MII_TXEN) ; port TXEN_A
WD_STATE_A: R85.2 U5.21(D0/AD0/WD_STATE/SI/SIO)
WD_TRIG_A: R258.2 U5.48(D3/AD3/WD_TRIG/SIO3/EE_EMUL_SPI1)
NetD1_1: D1.1 R251.1
NetD1_2: D1.2 R252.1
NetD1_3: D1.3 U3.4(2Y)
NetD1_4: D1.4 U3.6(1Y)
NetR102_1: R102.1 U5.10(WAIT_ACK/PME/LATCH0/EE_EMUL_SPI3)

### Notes on the sheet
- LAN9254-A2:
- DIGIO/MII
- (near U5) DIGITAL PORTS
- (near U3) Run and Error LEDs - A
- (near R33) E2PSIZE (pin 58) pull-up resistor for 512Kbit EEPROM which is organized as 64K x
- REVISION
- DESCRIPTION
- DATE
- DESIGNED:
- CHECKED:
- TITLE:
- FILE NAME:
- CUR REV:
- PCB:
- SHEET:
- DATE:
- OF

### Library data of the parts
C8 = 100nF_16V_0402_CAP: CAP CER 0.1UF 16V X7R 0402; Tolerance: 5%; MPN: GRM155R71C104JA88D; Voltage Rating: 16V; Temp Coeff: X7R; Size/Package: 0402
D1 = Green/Red_LED: LED GREEN/RED CLEAR CHIP SMD; Color: Green, Red; Voltage Vf: 2V Green, 2V Red; Current If: 20mA. 20mA; MPN: LTST-C195KGJRKT; Mounting Type: SMD; Supplier 1: Digi-Key; Supplier Part Number 1: 160-1452-1-ND
R27-R31 R35 R51 R54 R56 R58 R61 R85-R87 R105-R110 R257 R258 R279-R281 = 10k_1/16W_0402_RES: RES SMD 10K OHM 1% 1/16W 0402; MPN: RC0402FR-0710KL; Tolerance: 1%; Power: 1/16W; Size: 0402
R33 = 4k75_1/16_0402_RES: RES SMD 4.75K OHM 1% 1/16W 0402; Power: 1/16; MPN: RC0402FR-074K75L; Tolerance: 1%; Package/Case: 0402
R102 = 0R_1/5W_0402_RCS04020000Z0ED_RES: as R25 on sheet ECAT SWITCH; Supplier 1: Digi-Key; Supplier Part Number 1: 541-2877-1-ND; Manufacturer Part Number: RCS04020000Z0ED; RoHS: Yes; Category: Chip SMD Resistors; Stock 1: 18214; Pricing 1: 1=0.10000, 10=0.08300, 25=0.05760, 50=0.04480, 100=0.03200, 250=0.02496, 500=0.01984, 1000=0.01408, 5000=0.01088 (USD); Case/Package: 0402; Case Code (Metric): 1005; Case Code (Imperial): 0402; Min Operating Temperature: -55°C; Max Operating Temperature: 155°C; Packaging: Tape and Reel; Resistor Type: Thick Film; Number of Terminations: 2; Features: Automotive AEC-Q200; Length: 0.039inch; Width: 0.02inch; Height: 0.016inch; RoHS Compliant: Yes; ComponentLink1URL: http://www.farnell.com/datasheets/2618474.pdf?src-supplier=Farnell; ComponentLink1Description: http://www.farnell.com/datasheets/2618474.pdf?src-supplier=Farnell; ComponentLink2URL: http://www.vishay.com/docs/20065/rcse3.pdf?src-supplier=Digi-Key; ComponentLink2Description: http://www.vishay.com/docs/20065/rcse3.pdf?src-supplier=Digi-Key; ComponentLink3URL: http://www.farnell.com/datasheets/2618474.pdf?src-supplier=Element14; ComponentLink3Description: http://www.farnell.com/datasheets/2618474.pdf?src-supplier=Element14; ComponentLink4URL: http://www.farnell.com/datasheets/2618474.pdf?src-supplier=Newark; ComponentLink4Description: http://www.farnell.com/datasheets/2618474.pdf?src-supplier=Newark
R251 R252 = 470_1/10W_0402_CRCW0402470RJNED: Vishay CRCW Series Thick Film Resistor 0402 Case 470 5% 0.063W 200ppm/K; Manufacturer: Vishay Dale; Resistance: 470R; Max Power Dissipation: 63mW; Temperature Coefficient: 200ppm/°C; Voltage Rating: 50V; Supplier 1: Digi-Key; Manufacturer Part Number: CRCW0402470RJNED; RoHS: Yes; Category: Chip SMD Resistors; Pricing 1: 1=0,10000, 10=0,03300, 100=0,01360, 1000=0,00610, 2500=0,00529, 5000=0,00437 (USD); Case/Package: 0402; Number of Pins: 2; Weight: 2.3E-05oz; Case Code (Metric): 1005; Case Code (Imperial): 0402; Contact Plating: Tin; Min Operating Temperature: -55°C; Max Operating Temperature: 155°C; Packaging: Tape and Reel; Tolerance: 5%; Package Quantity: 1; Resistor Type: Thick Film; Number of Terminations: 2; Features: Automotive AEC-Q200; Power Rating: 63mW; Termination: SMD/SMT; Series: CRCW; Voltage Rating (DC): 50V; Resistance Tolerance: 5%; Construction: Rectangular; Technology: THICK FILM; Length: 1mm; Width: 0.02inch; Height: 0.35mm; Depth: 0.5mm; Radiation Hardening: No; RoHS Compliant: Yes; Lead Free: Lead Free; Military Standard: Not; REACH SVHC: Unknown; ComponentLink1URL: https://datasheet.ciiva.com/2461/dcrcwe3-2461992.pdf?src-supplier=Digi-Key; ComponentLink1Description: https://datasheet.ciiva.com/2461/dcrcwe3-2461992.pdf?src-supplier=Digi-Key; ComponentLink2URL: https://datasheet.ciiva.com/2461/dcrcwe3-2461993.pdf?src-supplier=Digi-Key; ComponentLink2Description: https://datasheet.ciiva.com/2461/dcrcwe3-2461993.pdf?src-supplier=Digi-Key; ComponentLink3URL: https://datasheet.ciiva.com/2461/dcrcwe3-2461994.pdf?src-supplier=Digi-Key; ComponentLink3Description: https://datasheet.ciiva.com/2461/dcrcwe3-2461994.pdf?src-supplier=Digi-Key; ComponentLink4URL: https://datasheet.ciiva.com/5550/dcrcwe3-109170-5550440.pdf?src-supplier=Mouser; ComponentLink4Description: https://datasheet.ciiva.com/5550/dcrcwe3-109170-5550440.pdf?src-supplier=Mouser; ComponentLink5URL: https://datasheet.ciiva.com/3256/dcrcwe3-3256554.pdf?src-supplier=Avnet; ComponentLink5Description: https://datasheet.ciiva.com/3256/dcrcwe3-3256554.pdf?src-supplier=Avnet; ComponentLink6URL: https://datasheet.ciiva.com/8336/dcrcwe3-8336717.pdf?src-supplier=Avnet; ComponentLink6Description: https://datasheet.ciiva.com/8336/dcrcwe3-8336717.pdf?src-supplier=Avnet; ComponentLink7URL: https://datasheet.ciiva.com/28571/1847332-28571880.pdf?src-supplier=Element14; ComponentLink7Description: https://datasheet.ciiva.com/28571/1847332-28571880.pdf?src-supplier=Element14; Supplier Part Number 1: 541-470JDKR-ND
R254 R255 = 1M5_1/16W_0402_CRCW04021M50JNED_RES: RES SMD 1.5M OHM 5% 1/16W 0402; Manufacturer: Vishay Dale; Resistance: 1.5MR; Power Rating: 63mW; Voltage Rating: 50V; Temperature Coefficient: 200ppm/°C; Supplier 1: Digi-Key; Manufacturer Part Number: CRCW04021M50JNED; RoHS: Yes; Category: Chip SMD Resistors; Stock 1: 7870; Pricing 1: 1=0,10000, 10=0,03300, 100=0,01360, 1000=0,00610, 2500=0,00529, 5000=0,00437 (USD); Case/Package: 0402; Weight: 2.3E-05oz; Case Code (Imperial): 0402; Case Code (Metric): 1005; Contact Plating: Tin; Min Operating Temperature: -55°C; Max Operating Temperature: 155°C; Tolerance: 5%; Package Quantity: 1; Packaging: Tape and Reel; Termination: SMD/SMT; Resistor Type: Thick Film; Number of Terminations: 2; Max Power Dissipation: 63mW; Voltage Rating (DC): 50V; Features: Automotive AEC-Q200; Series: CRCW; Construction: Rectangular; Length: 1mm; Width: 0.5mm; Height: 0.016inch; Depth: 0.5mm; Radiation Hardening: No; RoHS Compliant: Yes; Military Standard: Not; Lead Free: Lead Free; ComponentLink1URL: https://datasheet.ciiva.com/9100/dcrcwe3-9100251.pdf?src-supplier=Avnet; ComponentLink1Description: https://datasheet.ciiva.com/9100/dcrcwe3-9100251.pdf?src-supplier=Avnet; ComponentLink2URL: https://datasheet.ciiva.com/2493/dcrcwe3-2493529.pdf?src-supplier=Digi-Key; ComponentLink2Description: https://datasheet.ciiva.com/2493/dcrcwe3-2493529.pdf?src-supplier=Digi-Key; ComponentLink3URL: https://datasheet.ciiva.com/2493/dcrcwe3-2493530.pdf?src-supplier=Digi-Key; ComponentLink3Description: https://datasheet.ciiva.com/2493/dcrcwe3-2493530.pdf?src-supplier=Digi-Key; ComponentLink4URL: https://datasheet.ciiva.com/2493/dcrcwe3-2493531.pdf?src-supplier=Digi-Key; ComponentLink4Description: https://datasheet.ciiva.com/2493/dcrcwe3-2493531.pdf?src-supplier=Digi-Key; Supplier Part Number 1: 541-1.5MJCT-ND
U3 = BUF_dual_SN74LVC2G06DBVR: Buffer/Driver 2-CH Inverting Open Drain CMOS 6-Pin SOT-23 T/R; Manufacturer: Texas Instruments; Number of Channels: 2; Propagation Delay: 2.9ns; Min Supply Voltage: 1.65V; High Level Output Current: 32mA; Logic Function: Buffer; Max Supply Voltage: 5.5V; Nominal Supply Current: 40mA; Turn-On Delay Time: 7.2ns; Quiescent Current: 10uA; Number of Inputs: 1; Height: 1.15mm; Radiation Hardening: No; Length: 2.9mm; Number of Output Lines: 2; Package Quantity: 3000; Min Operating Temperature: -40°C; Case/Package: SOT-23; REACH SVHC: No SVHC; Number of Elements: 2; Number of Pins: 6; Mount: Surface Mount; Polarity: Inverting; Contact Plating: Gold; Number of Input Lines: 2; Number of Outputs: 2; Number of Circuits: 2; Number of Gates: 2; Max Operating Temperature: 125°C; RoHS Compliant: Yes; Low Level Output Current: 32mA; Number of Bits: 2; Width: 1.6mm; Packaging: Tape and Reel; Lead Free: Lead Free; Supplier 1: Digi-Key; Manufacturer Part Number: SN74LVC2G06DBVR; RoHS: Yes; Category: Logic Gates; Stock 1: 3468; Pricing 1: 1=0,47000, 10=0,35600, 25=0,32080, 100=0,22150, 250=0,18656, 500=0,15158, 1000=0,11660 (USD); ComponentLink1URL: https://datasheet.ciiva.com/22719/1737061-22719510.pdf?src-supplier=Element14; ComponentLink1Description: https://datasheet.ciiva.com/22719/1737061-22719510.pdf?src-supplier=Element14; ComponentLink2URL: https://datasheet.ciiva.com/7293/sn74lvc2g06-7293674.pdf?src-supplier=Newark; ComponentLink2Description: https://datasheet.ciiva.com/7293/sn74lvc2g06-7293674.pdf?src-supplier=Newark; ComponentLink3URL: https://datasheet.ciiva.com/46439/1786796-46439655.pdf?src-supplier=Element14; ComponentLink3Description: https://datasheet.ciiva.com/46439/1786796-46439655.pdf?src-supplier=Element14; ComponentLink4URL: https://datasheet.ciiva.com/1864/sn74lvc2g06-1864312.pdf?src-supplier=Digi-Key; ComponentLink4Description: https://datasheet.ciiva.com/1864/sn74lvc2g06-1864312.pdf?src-supplier=Digi-Key; ComponentLink5URL: https://datasheet.ciiva.com/1864/sn74lvc2g06-1864311.pdf?src-supplier=Digi-Key; ComponentLink5Description: https://datasheet.ciiva.com/1864/sn74lvc2g06-1864311.pdf?src-supplier=Digi-Key; ComponentLink6URL: https://datasheet.ciiva.com/1864/sn74lvc2g06-1864313.pdf?src-supplier=Digi-Key; ComponentLink6Description: https://datasheet.ciiva.com/1864/sn74lvc2g06-1864313.pdf?src-supplier=Digi-Key; ComponentLink7URL: https://datasheet.ciiva.com/14301/sn74lvc2g06-14301182.pdf?src-supplier=Avnet; ComponentLink7Description: https://datasheet.ciiva.com/14301/sn74lvc2g06-14301182.pdf?src-supplier=Avnet; ComponentLink8URL: https://datasheet.ciiva.com/26220/sn74lvc2g06-26220937.pdf?src-supplier=Avnet+Europe; ComponentLink8Description: https://datasheet.ciiva.com/26220/sn74lvc2g06-26220937.pdf?src-supplier=Avnet+Europe; Supplier Part Number 1: 296-13492-1-ND
U5 = LAN9254-I/JRX: 2/3-PORT Ethercat Slave Controller With 32 Digios With Integrated Ethernet Phys; Manufacturer: Microchip; Supplier 1: Digi-Key; Manufacturer Part Number: LAN9254-I/JRX; RoHS: Yes; Pricing 1: 1=14.24000, 25=12.99000 (USD); RoHS Compliant: Yes; Supplier Part Number 1: 150-LAN9254-I/JRX-ND